# EAGLE design sensor (EAGLE 6.5.0)
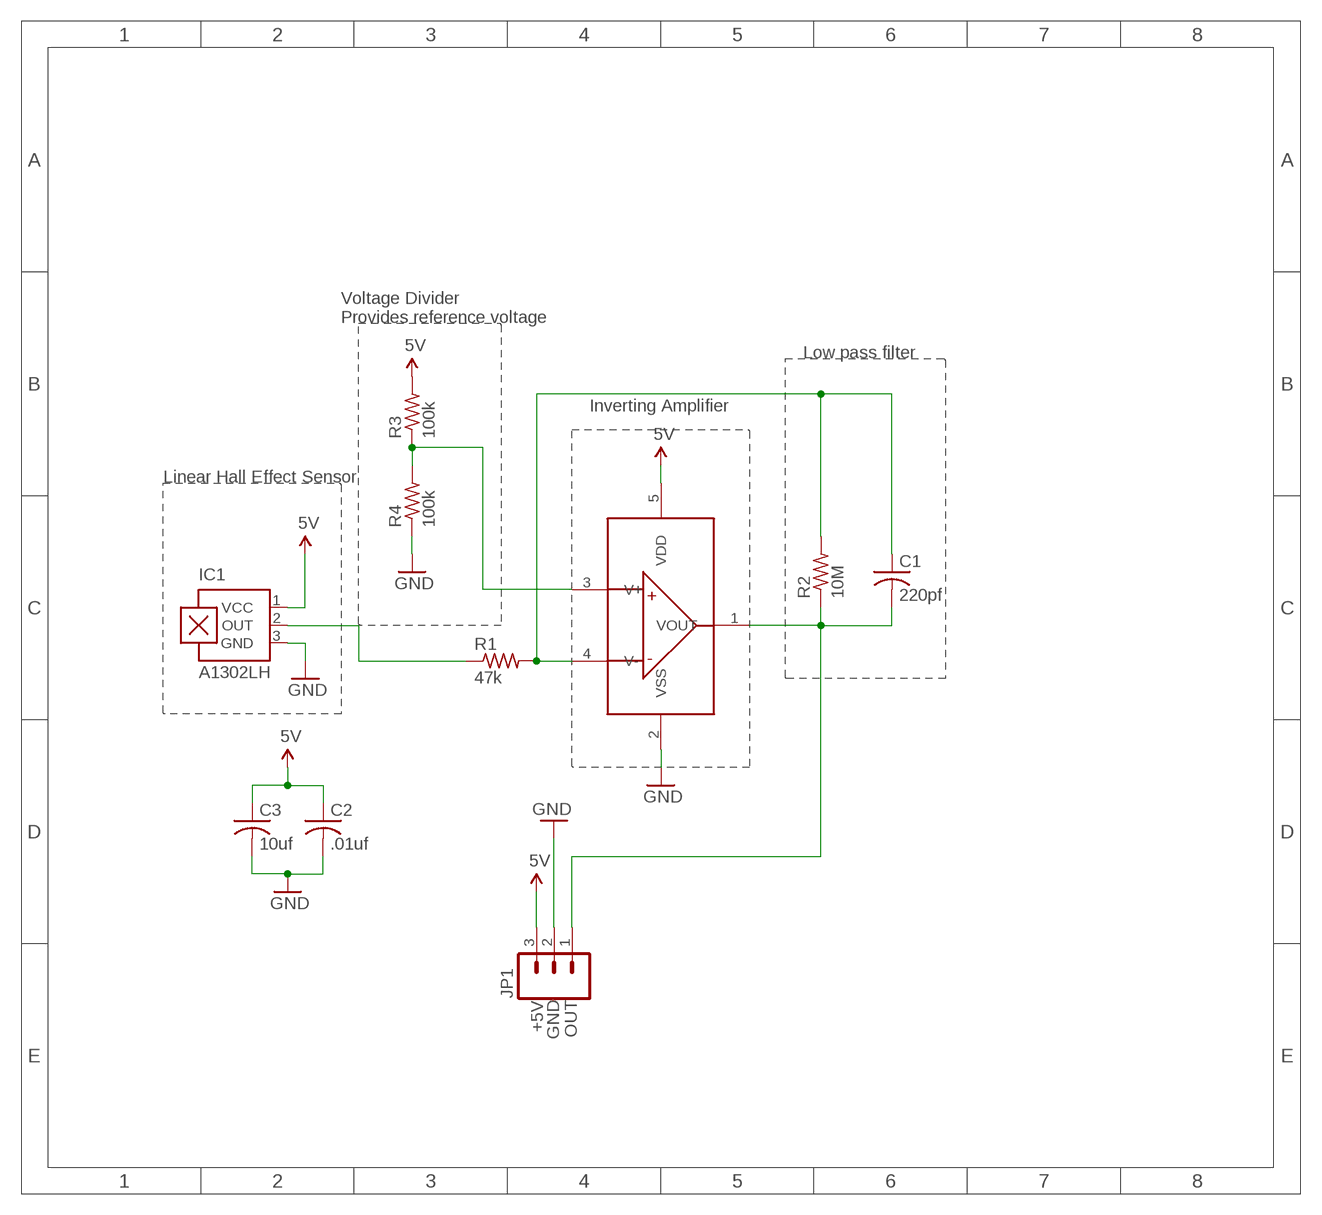
[diagram p0: schematic, sheet 1]

## Parts
C1  220pf  C-USC0805  [C0805]
C2  .01uf  C-USC0805  [C0805]
C3  10uf  C-USC0805  [C0805]
IC1  A1302LH  [SOT23-W]
JP1  M03PTH  [1X03]
R1  47k  R-US_R0805  [R0805]
R2  10M  R-US_R0805  [R0805]
R3  100k  R-US_R0805  [R0805]
R4  100k  R-US_R0805  [R0805]
U$1  MCP601  [SOT23-5]

## Nets
5V: C2.1 C3.1 IC1.1(VCC) JP1.3 R3.2 U$1.5(VDD)
GND: C2.2 C3.2 IC1.3(GND) JP1.2 R4.1 U$1.2(VSS)
N$1: C1.2 JP1.1 R2.1 U$1.1(VOUT)
N$2: IC1.2(OUT) R1.1
N$3: C1.1 R1.2 R2.2 U$1.4(V-)
N$5: R3.1 R4.2 U$1.3(V+)

## Notes on the sheet
- Voltage Divider
  Provides reference voltage
- Low pass filter
- Inverting Amplifier
- Linear Hall Effect Sensor
- +5V
- GND | OUT

## Library data of the parts
C1-C3 = rcl:C-US: CAPACITOR, American symbol
IC1 = allegro:A13*?: Linear Hall Effect Sensor ICs Continuous-Time Ratiometric High-Temperature Operation Programmable Linear with Analog Output A1302 -Replacement- UGN3503 Source: http://www.allegromicro.com/en/Products/Part_Numbers/1301/1301.pdf http://www.allegromicro.com/en/Products/Part_Numbers/1321/1321.pdf http://www.allegromicro.com/en/Products/Part_Numbers/1381/1381.pdf; MF: ALLEGRO MICROSYSTEMS, INC.; MPN: A1302ELHLT-T; OC_FARNELL: 1457209; OC_NEWARK: 31K6638
JP1 = SparkFun:M03: Header 3 Standard 3-pin 0.1" header. Use with straight break away headers (SKU : PRT-00116), right angle break away headers (PRT-00553), swiss pins (PRT-00743), machine pins (PRT-00117), and female headers (PRT-00115). Molex polarized connector foot print use with SKU : PRT-08232 with associated crimp pins and housings.
R1-R4 = rcl:R-US_: RESISTOR, American symbol
U$1 = SparkFun:MCP601

## Board
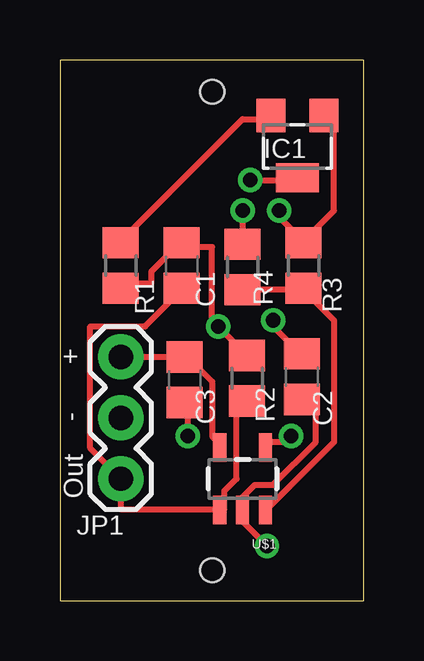
[diagram p1: board, top side]
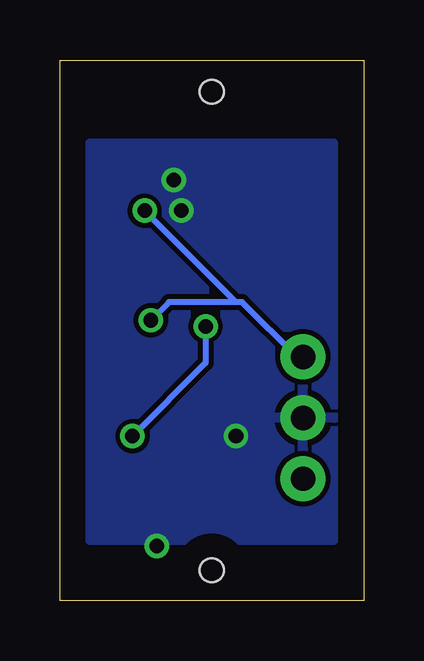
[diagram p2: board, bottom side, seen from below]

Size 12.68 x 22.53 mm. Coordinates in mm from the lower left corner, seen from the top.
Outline: 0,0 12.68,0 12.68,22.53 0,22.53 0,0
Copper layers (1*16): Top 0.035mm / dielectric 1.5mm / Bottom 0.035mm
Design rules "default": minimum track width 10mil, minimum drill 24mil, track to track 8mil, track to pad 8mil, pad to pad 8mil, via to via 8mil, smd to smd 8mil, copper to edge 40mil, drill to drill 8mil, minimum pad ring 10mil, minimum via ring 8mil, stop-mask expansion 4mil, vias tented up to drill 0mil, thermal gap 10mil
Holes 1 mm at 6.35,1.27 6.35,21.21

### Footprints (pad centres in the part's own frame; a part is rotated, then mirrored left to right if it is on the bottom)
C0805 = smd 1.3 x 1.5: 1 -0.95,0; 2 0.95,0
SOT23-W = smd 1.2 x 1.4: 1 -1.1,-1.3; 2 1.1,-1.3 | smd 1.8 x 1.2: 3 0,1.3
1X03 = drill 1.016 pad 1.88: 1 0,0; 2 2.54,0; 3 5.08,0
R0805 = smd 1.3 x 1.5: 1 -0.95,0; 2 0.95,0
SOT23-5 = smd 0.55 x 1.2: 1 -0.95,-1.3; 2 0,-1.3; 3 0.95,-1.3; 4 0.95,1.3; 5 -0.95,1.3

### Placement (x,y rotation side)
C1  5.08,13.97 270 top
C2  10.1,9.33 270 top
C3  5.21,9.21 270 top
IC1  9.91,18.92 180 top
JP1  2.54,5.08 90 top
R1  2.54,13.97 270 top
R2  7.81,9.27 90 top
R3  10.16,13.97 90 top
R4  7.62,13.91 270 top
U$1  7.62,5.08 0 top

### Tracks (layer width: path | path; a pad name or v marks a point on that pad's centre or on a via)
5V  (via drill 0.61)
  Top 0.254: 10.16,14.99 11.43,16.26 11.43,19.81 11.18,20.07 IC1.1 | 10.16,14.99 R3.2 10.16,14.99 | U$1.5 6.6,6.6 6.35,6.86 6.35,9.14 5.33,10.16 C3.1 5.08,10.16 JP1.3 | v8.89,11.68 8.89,11.43 9.91,10.41 C2.1 | 10.16,14.99 9.14,16 v9.14,16.26
  Bottom 0.254: v8.89,11.68 8.13,12.45 5.33,12.45 | 5.33,12.45 5.08,12.45 2.79,10.16 JP1.3 | 5.33,12.45 v9.14,16.26
GND  (via drill 0.61)
  Top 0.254: v8.64,2.29 7.62,3.3 7.62,3.56 U$1.2 7.62,3.81 7.62,4.32 8.13,4.83 8.89,4.83 10.67,6.6 10.67,8.38 10.16,8.38 C2.2 | v5.33,6.86 5.33,8.13 C3.2 | v7.62,16.26 7.62,14.99 R4.1 | v7.94,17.53 9.91,17.53 IC1.3
  Bottom 0.254: 8.64,2.54 v8.64,2.29
  pour Bottom: 1.27,19.05 11.43,19.05 11.43,2.54 1.27,2.54
N$1
  Top 0.254: C1.2 5.08,12.95 3.56,11.43 1.27,11.43 1.27,6.35 JP1.1 2.54,3.81 6.6,3.81 U$1.1 6.86,3.81 6.86,4.57 7.37,5.08 7.37,7.87 7.62,8.13 R2.1
N$2
  Top 0.254: IC1.2 8.89,20.07 7.62,20.07 2.54,14.99 R1.1
N$3  (via drill 0.61)
  Top 0.254: R1.2 2.54,13.21 3.81,13.21 3.81,13.72 5.08,14.99 C1.1 5.08,14.73 6.35,14.73 6.35,11.68 v6.6,11.43 7.62,10.41 R2.2 | v9.65,6.86 9.65,6.6 8.64,6.6 U$1.4
  Bottom 0.254: v9.65,6.86 6.6,9.91 v6.6,11.43
N$5
  Top 0.254: 10.16,12.95 11.43,11.68 11.43,6.6 8.64,3.81 U$1.3 | 10.16,12.95 R3.1 10.16,12.95 | 10.16,12.95 R4.2

### Text on the board
tNames: + | - | Out